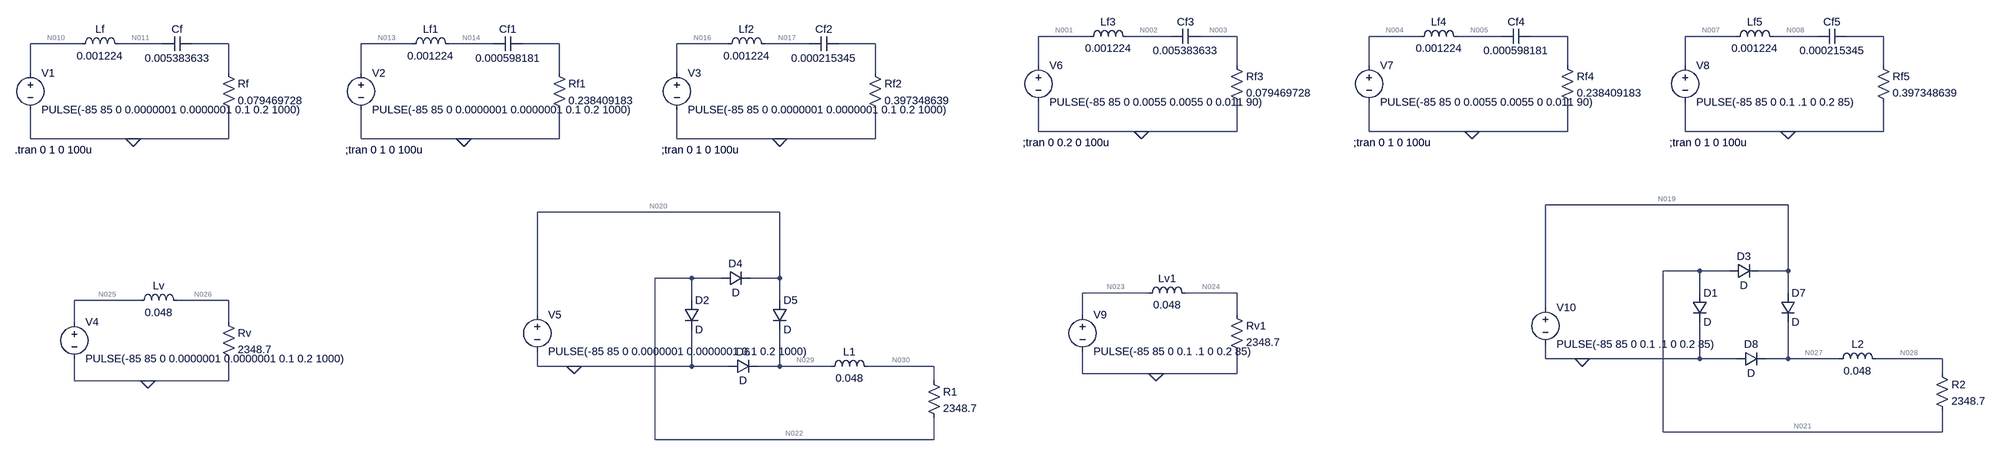
[diagram p0: schematic Draft1.asc]
Draft1.asc, the LTspice schematic file:
Version 4
SHEET 1 4488 948
WIRE 2528 64 2416 64
WIRE 2704 64 2608 64
WIRE 2848 64 2768 64
WIRE 3248 64 3136 64
WIRE 3424 64 3328 64
WIRE 3568 64 3488 64
WIRE 3936 64 3824 64
WIRE 4112 64 4016 64
WIRE 4256 64 4176 64
WIRE 176 80 64 80
WIRE 352 80 256 80
WIRE 496 80 416 80
WIRE 896 80 784 80
WIRE 1072 80 976 80
WIRE 1216 80 1136 80
WIRE 1584 80 1472 80
WIRE 1760 80 1664 80
WIRE 1904 80 1824 80
WIRE 2416 128 2416 64
WIRE 2848 128 2848 64
WIRE 3136 128 3136 64
WIRE 3568 128 3568 64
WIRE 3824 128 3824 64
WIRE 4256 128 4256 64
WIRE 64 144 64 80
WIRE 496 144 496 80
WIRE 784 144 784 80
WIRE 1216 144 1216 80
WIRE 1472 144 1472 80
WIRE 1904 144 1904 80
WIRE 2416 272 2416 208
WIRE 2640 272 2416 272
WIRE 2848 272 2848 208
WIRE 2848 272 2640 272
WIRE 3136 272 3136 208
WIRE 3360 272 3136 272
WIRE 3568 272 3568 208
WIRE 3568 272 3360 272
WIRE 3824 272 3824 208
WIRE 4048 272 3824 272
WIRE 4256 272 4256 208
WIRE 4256 272 4048 272
WIRE 64 288 64 224
WIRE 288 288 64 288
WIRE 496 288 496 224
WIRE 496 288 288 288
WIRE 784 288 784 224
WIRE 1008 288 784 288
WIRE 1216 288 1216 224
WIRE 1216 288 1008 288
WIRE 1472 288 1472 224
WIRE 1696 288 1472 288
WIRE 1904 288 1904 224
WIRE 1904 288 1696 288
WIRE 4048 432 3520 432
WIRE 1696 448 1168 448
WIRE 3856 576 3776 576
WIRE 3920 576 3856 576
WIRE 4048 576 4048 432
WIRE 4048 576 3984 576
WIRE 1504 592 1424 592
WIRE 1568 592 1504 592
WIRE 1696 592 1696 448
WIRE 1696 592 1632 592
WIRE 2656 624 2512 624
WIRE 2848 624 2736 624
WIRE 3856 624 3856 576
WIRE 4048 624 4048 576
WIRE 304 640 160 640
WIRE 496 640 384 640
WIRE 1504 640 1504 592
WIRE 1696 640 1696 592
WIRE 3520 656 3520 432
WIRE 1168 672 1168 448
WIRE 2512 672 2512 624
WIRE 2848 672 2848 624
WIRE 160 688 160 640
WIRE 496 688 496 640
WIRE 3520 768 3520 736
WIRE 3600 768 3520 768
WIRE 3856 768 3856 688
WIRE 3856 768 3600 768
WIRE 3936 768 3856 768
WIRE 4048 768 4048 688
WIRE 4048 768 4000 768
WIRE 4160 768 4048 768
WIRE 4384 768 4240 768
WIRE 1168 784 1168 752
WIRE 1248 784 1168 784
WIRE 1504 784 1504 704
WIRE 1504 784 1248 784
WIRE 1584 784 1504 784
WIRE 1696 784 1696 704
WIRE 1696 784 1648 784
WIRE 1808 784 1696 784
WIRE 2032 784 1888 784
WIRE 2512 800 2512 752
WIRE 2672 800 2512 800
WIRE 2848 800 2848 752
WIRE 2848 800 2672 800
WIRE 4384 800 4384 768
WIRE 160 816 160 768
WIRE 320 816 160 816
WIRE 496 816 496 768
WIRE 496 816 320 816
WIRE 2032 816 2032 784
WIRE 3776 928 3776 576
WIRE 4384 928 4384 880
WIRE 4384 928 3776 928
WIRE 1424 944 1424 592
WIRE 2032 944 2032 896
WIRE 2032 944 1424 944
FLAG 288 288 0
FLAG 1008 288 0
FLAG 1696 288 0
FLAG 320 816 0
FLAG 1248 784 0
FLAG 2640 272 0
FLAG 3360 272 0
FLAG 4048 272 0
FLAG 2672 800 0
FLAG 3600 768 0
SYMBOL voltage 64 128 R0
WINDOW 123 0 0 Left 0
WINDOW 39 0 0 Left 0
SYMATTR InstName V1
SYMATTR Value PULSE(-85 85 0 0.0000001 0.0000001 0.1 0.2 1000)
SYMBOL ind 160 96 R270
WINDOW 0 32 56 VTop 2
WINDOW 3 5 56 VBottom 2
SYMATTR InstName Lf
SYMATTR Value 0.001224
SYMBOL cap 416 64 R90
WINDOW 0 0 32 VBottom 2
WINDOW 3 32 32 VTop 2
SYMATTR InstName Cf
SYMATTR Value 0.005383633
SYMBOL res 480 128 R0
SYMATTR InstName Rf
SYMATTR Value 0.079469728
SYMBOL voltage 784 128 R0
WINDOW 123 0 0 Left 0
WINDOW 39 0 0 Left 0
SYMATTR InstName V2
SYMATTR Value PULSE(-85 85 0 0.0000001 0.0000001 0.1 0.2 1000)
SYMBOL ind 880 96 R270
WINDOW 0 32 56 VTop 2
WINDOW 3 5 56 VBottom 2
SYMATTR InstName Lf1
SYMATTR Value 0.001224
SYMBOL cap 1136 64 R90
WINDOW 0 0 32 VBottom 2
WINDOW 3 32 32 VTop 2
SYMATTR InstName Cf1
SYMATTR Value 0.000598181
SYMBOL res 1200 128 R0
SYMATTR InstName Rf1
SYMATTR Value 0.238409183
SYMBOL voltage 1472 128 R0
WINDOW 123 0 0 Left 0
WINDOW 39 0 0 Left 0
SYMATTR InstName V3
SYMATTR Value PULSE(-85 85 0 0.0000001 0.0000001 0.1 0.2 1000)
SYMBOL ind 1568 96 R270
WINDOW 0 32 56 VTop 2
WINDOW 3 5 56 VBottom 2
SYMATTR InstName Lf2
SYMATTR Value 0.001224
SYMBOL cap 1824 64 R90
WINDOW 0 0 32 VBottom 2
WINDOW 3 32 32 VTop 2
SYMATTR InstName Cf2
SYMATTR Value 0.000215345
SYMBOL res 1888 128 R0
SYMATTR InstName Rf2
SYMATTR Value 0.397348639
SYMBOL voltage 160 672 R0
SYMATTR InstName V4
SYMATTR Value PULSE(-85 85 0 0.0000001 0.0000001 0.1 0.2 1000)
SYMBOL ind 288 656 R270
WINDOW 0 32 56 VTop 2
WINDOW 3 5 56 VBottom 2
SYMATTR InstName Lv
SYMATTR Value 0.048
SYMBOL res 480 672 R0
SYMATTR InstName Rv
SYMATTR Value 2348.7
SYMBOL voltage 1168 656 R0
SYMATTR InstName V5
SYMATTR Value PULSE(-85 85 0 0.0000001 0.0000001 0.1 0.2 1000)
SYMBOL diode 1488 640 R0
SYMATTR InstName D2
SYMBOL diode 1568 608 R270
WINDOW 0 32 32 VTop 2
WINDOW 3 0 32 VBottom 2
SYMATTR InstName D4
SYMBOL diode 1680 640 R0
SYMATTR InstName D5
SYMBOL diode 1584 800 R270
WINDOW 0 32 32 VTop 2
WINDOW 3 0 32 VBottom 2
SYMATTR InstName D6
SYMBOL ind 1792 800 R270
WINDOW 0 32 56 VTop 2
WINDOW 3 5 56 VBottom 2
SYMATTR InstName L1
SYMATTR Value 0.048
SYMBOL res 2016 800 R0
SYMATTR InstName R1
SYMATTR Value 2348.7
SYMBOL voltage 2416 112 R0
WINDOW 123 0 0 Left 0
WINDOW 39 0 0 Left 0
SYMATTR InstName V6
SYMATTR Value PULSE(-85 85 0 0.0055 0.0055 0 0.011 90)
SYMBOL ind 2512 80 R270
WINDOW 0 32 56 VTop 2
WINDOW 3 5 56 VBottom 2
SYMATTR InstName Lf3
SYMATTR Value 0.001224
SYMBOL cap 2768 48 R90
WINDOW 0 0 32 VBottom 2
WINDOW 3 32 32 VTop 2
SYMATTR InstName Cf3
SYMATTR Value 0.005383633
SYMBOL res 2832 112 R0
SYMATTR InstName Rf3
SYMATTR Value 0.079469728
SYMBOL voltage 3136 112 R0
WINDOW 123 0 0 Left 0
WINDOW 39 0 0 Left 0
SYMATTR InstName V7
SYMATTR Value PULSE(-85 85 0 0.0055 0.0055 0 0.011 90)
SYMBOL ind 3232 80 R270
WINDOW 0 32 56 VTop 2
WINDOW 3 5 56 VBottom 2
SYMATTR InstName Lf4
SYMATTR Value 0.001224
SYMBOL cap 3488 48 R90
WINDOW 0 0 32 VBottom 2
WINDOW 3 32 32 VTop 2
SYMATTR InstName Cf4
SYMATTR Value 0.000598181
SYMBOL res 3552 112 R0
SYMATTR InstName Rf4
SYMATTR Value 0.238409183
SYMBOL voltage 3824 112 R0
WINDOW 123 0 0 Left 0
WINDOW 39 0 0 Left 0
SYMATTR InstName V8
SYMATTR Value PULSE(-85 85 0 0.1 .1 0 0.2 85)
SYMBOL ind 3920 80 R270
WINDOW 0 32 56 VTop 2
WINDOW 3 5 56 VBottom 2
SYMATTR InstName Lf5
SYMATTR Value 0.001224
SYMBOL cap 4176 48 R90
WINDOW 0 0 32 VBottom 2
WINDOW 3 32 32 VTop 2
SYMATTR InstName Cf5
SYMATTR Value 0.000215345
SYMBOL res 4240 112 R0
SYMATTR InstName Rf5
SYMATTR Value 0.397348639
SYMBOL voltage 2512 656 R0
SYMATTR InstName V9
SYMATTR Value PULSE(-85 85 0 0.1 .1 0 0.2 85)
SYMBOL ind 2640 640 R270
WINDOW 0 32 56 VTop 2
WINDOW 3 5 56 VBottom 2
SYMATTR InstName Lv1
SYMATTR Value 0.048
SYMBOL res 2832 656 R0
SYMATTR InstName Rv1
SYMATTR Value 2348.7
SYMBOL voltage 3520 640 R0
SYMATTR InstName V10
SYMATTR Value PULSE(-85 85 0 0.1 .1 0 0.2 85)
SYMBOL diode 3840 624 R0
SYMATTR InstName D1
SYMBOL diode 3920 592 R270
WINDOW 0 32 32 VTop 2
WINDOW 3 0 32 VBottom 2
SYMATTR InstName D3
SYMBOL diode 4032 624 R0
SYMATTR InstName D7
SYMBOL diode 3936 784 R270
WINDOW 0 32 32 VTop 2
WINDOW 3 0 32 VBottom 2
SYMATTR InstName D8
SYMBOL ind 4144 784 R270
WINDOW 0 32 56 VTop 2
WINDOW 3 5 56 VBottom 2
SYMATTR InstName L2
SYMATTR Value 0.048
SYMBOL res 4368 784 R0
SYMATTR InstName R2
SYMATTR Value 2348.7
TEXT 30 312 Left 2 !.tran 0 1 0 100u
TEXT 750 312 Left 2 !;tran 0 1 0 100u
TEXT 1438 312 Left 2 !;tran 0 1 0 100u
TEXT 2382 296 Left 2 !;tran 0 0.2 0 100u
TEXT 3102 296 Left 2 !;tran 0 1 0 100u
TEXT 3790 296 Left 2 !;tran 0 1 0 100u

The netlist it stands for:
* Draft1.asc
V1 N010 0 PULSE(-85 85 0 0.0000001 0.0000001 0.1 0.2 1000)
Lf N010 N011 0.001224
Cf N012 N011 0.005383633
Rf N012 0 0.079469728
V2 N013 0 PULSE(-85 85 0 0.0000001 0.0000001 0.1 0.2 1000)
Lf1 N013 N014 0.001224
Cf1 N015 N014 0.000598181
Rf1 N015 0 0.238409183
V3 N016 0 PULSE(-85 85 0 0.0000001 0.0000001 0.1 0.2 1000)
Lf2 N016 N017 0.001224
Cf2 N018 N017 0.000215345
Rf2 N018 0 0.397348639
V4 N025 0 PULSE(-85 85 0 0.0000001 0.0000001 0.1 0.2 1000)
Lv N025 N026 0.048
Rv N026 0 2348.7
V5 N020 0 PULSE(-85 85 0 0.0000001 0.0000001 0.1 0.2 1000)
D2 N022 0 D
D4 N022 N020 D
D5 N020 N029 D
D6 0 N029 D
L1 N029 N030 0.048
R1 N030 N022 2348.7
V6 N001 0 PULSE(-85 85 0 0.0055 0.0055 0 0.011 90)
Lf3 N001 N002 0.001224
Cf3 N003 N002 0.005383633
Rf3 N003 0 0.079469728
V7 N004 0 PULSE(-85 85 0 0.0055 0.0055 0 0.011 90)
Lf4 N004 N005 0.001224
Cf4 N006 N005 0.000598181
Rf4 N006 0 0.238409183
V8 N007 0 PULSE(-85 85 0 0.1 .1 0 0.2 85)
Lf5 N007 N008 0.001224
Cf5 N009 N008 0.000215345
Rf5 N009 0 0.397348639
V9 N023 0 PULSE(-85 85 0 0.1 .1 0 0.2 85)
Lv1 N023 N024 0.048
Rv1 N024 0 2348.7
V10 N019 0 PULSE(-85 85 0 0.1 .1 0 0.2 85)
D1 N021 0 D
D3 N021 N019 D
D7 N019 N027 D
D8 0 N027 D
L2 N027 N028 0.048
R2 N028 N021 2348.7
.model D D
.lib standard.dio
.tran 0 1 0 100u
;tran 0 1 0 100u
;tran 0 1 0 100u
;tran 0 0.2 0 100u
;tran 0 1 0 100u
;tran 0 1 0 100u
.backanno
.end

* Results of the author's LTspice run, read from the files saved beside the schematic
* Operating Point, zero values left out:
*   V(n010) = -85 V
*   V(n011) = -85 V
*   V(n013) = -85 V
*   V(n014) = -85 V
*   V(n016) = -85 V
*   V(n017) = -85 V
*   V(n025) = -85 V
*   V(n026) = -85 V
*   V(n020) = -85 V
*   V(n022) = -84.25 V
*   V(n029) = -747.5 mV
*   V(n030) = -747.5 mV
*   V(n001) = -85 V
*   V(n002) = -85 V
*   V(n004) = -85 V
*   V(n005) = -85 V
*   V(n007) = -85 V
*   V(n008) = -85 V
*   V(n023) = -85 V
*   V(n024) = -85 V
*   V(n019) = -85 V
*   V(n021) = -84.25 V
*   V(n027) = -747.5 mV
*   V(n028) = -747.5 mV
*   I(D8) = 35.55 mA
*   I(D7) = -84.26 pA
*   I(D3) = 35.55 mA
*   I(D1) = -84.26 pA
*   I(D6) = 35.55 mA
*   I(D5) = -84.26 pA
*   I(D4) = 35.55 mA
*   I(D2) = -84.26 pA
*   I(L2) = 35.55 mA
*   I(Lv1) = -36.19 mA
*   I(Lf5) = -14.21 pA
*   I(Lf4) = -14.21 pA
*   I(Lf3) = -14.21 pA
*   I(L1) = 35.55 mA
*   I(Lv) = -36.19 mA
*   I(Lf2) = -14.21 pA
*   I(Lf1) = -14.21 pA
*   I(Lf) = -14.21 pA
*   I(R2) = 35.55 mA
*   I(Rv1) = -36.19 mA
*   I(R1) = 35.55 mA
*   I(Rv) = -36.19 mA
*   I(V10) = 35.55 mA
*   I(V9) = 36.19 mA
*   I(V8) = 14.55 pA
*   I(V7) = 14.55 pA
*   I(V6) = 14.55 pA
*   I(V5) = 35.55 mA
*   I(V4) = 36.19 mA
*   I(V3) = 14.55 pA
*   I(V2) = 14.55 pA
*   I(V1) = 14.55 pA
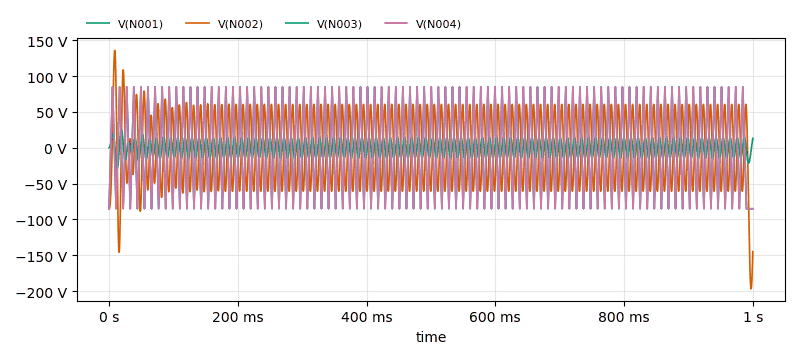
[diagram p1: Transient Analysis of Draft1.asc, plotted from the saved traces]
* Transient Analysis, 1 run:
*   V(N001): min -85 V, max 85 V, average -850 mV, rms 49.58 V, last -85 V
*   V(N002): min -196.8 V, max 136 V, average -1.051 V, rms 46.31 V, last -144.9 V
*   V(N003): min -28 V, max 26.01 V, average -31.19 mV, rms 10.36 V, last 13.07 V
*   V(N004): min -85 V, max 85 V, average -850 mV, rms 49.58 V, last -85 V